# Altium schematic sheet KEY_GPIO_NANDF_ENET.SchDoc
size A4
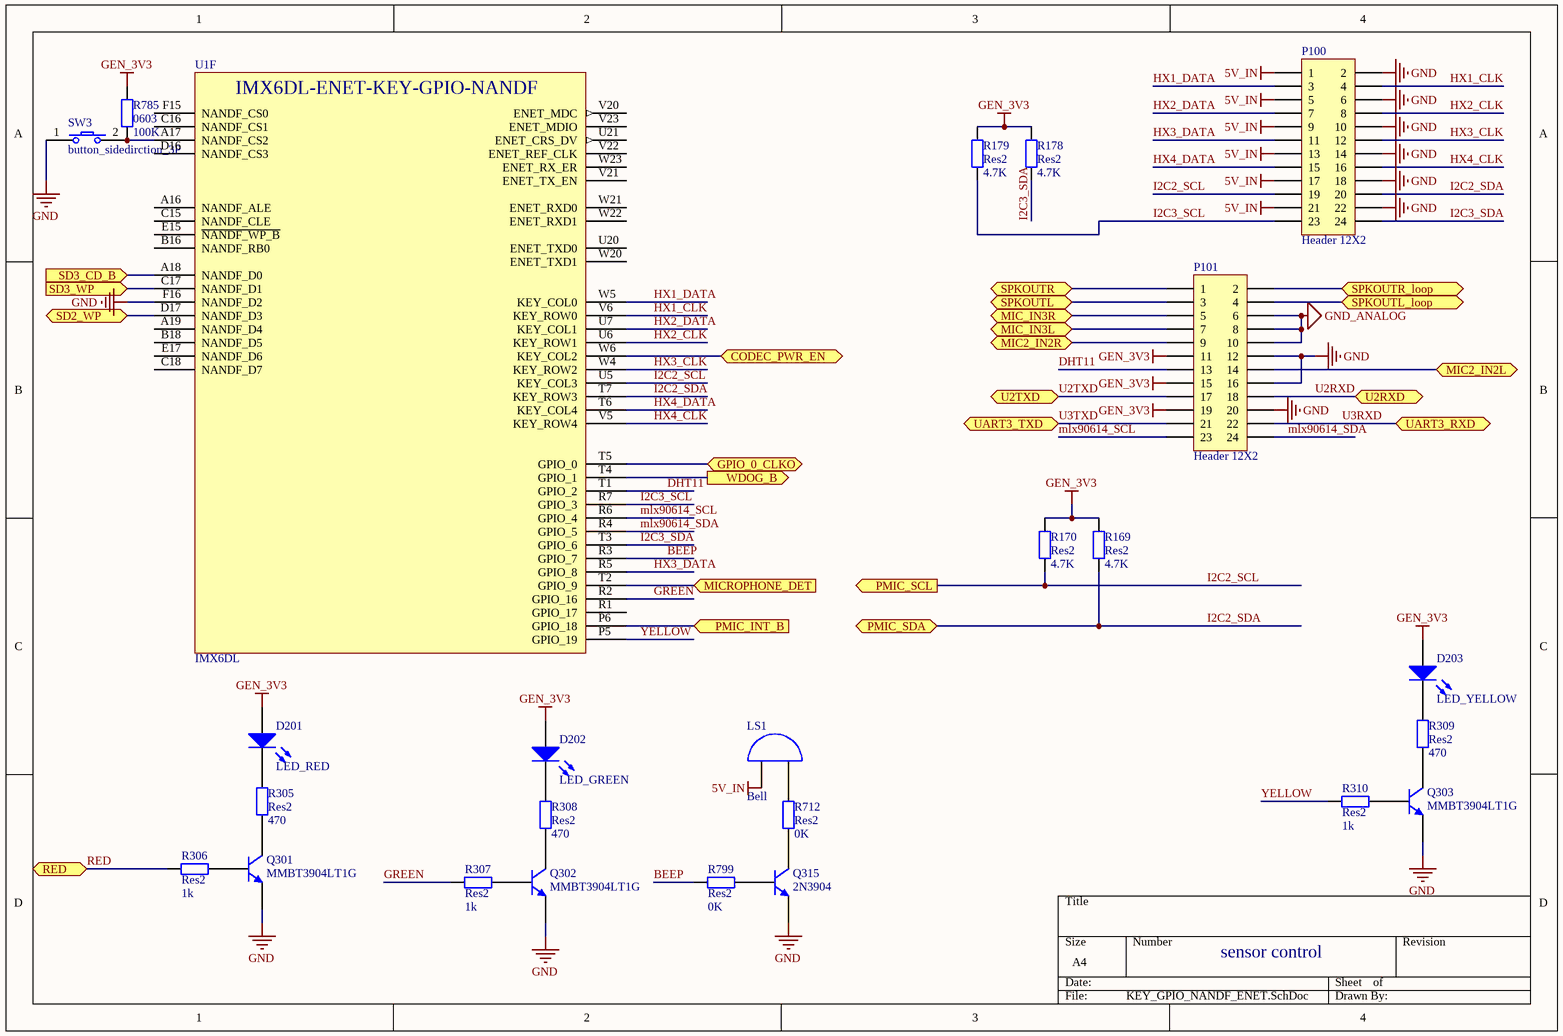
[diagram p0: KEY_GPIO_NANDF_ENET.SchDoc]

## Parts
D201  LED_RED  [LED_0603]
D202  LED_GREEN  [LED_0603]
D203  LED_YELLOW  [LED_0603]
LS1  Bell  [PIN2]
P100  Header 12X2  [Double Row _DIP43025- 2P-24P]
P101  Header 12X2  [Double Row _DIP43025- 2P-24P]
Q301  MMBT3904LT1G  [MMBT3904LT1G-SOT23]
Q302  MMBT3904LT1G  [MMBT3904LT1G-SOT23]
Q303  MMBT3904LT1G  [MMBT3904LT1G-SOT23]
Q315  2N3904  [BCY-W3/E4]
R169  Res2  value 4.7K  [0402]
R170  Res2  value 4.7K  [0402]
R178  Res2  value 4.7K  [0402]
R179  Res2  value 4.7K  [0402]
R305  Res2  value 470  [0603]
R306  Res2  value 1k  [0603]
R307  Res2  value 1k  [0603]
R308  Res2  value 470  [0603]
R309  Res2  value 470  [0603]
R310  Res2  value 1k  [0603]
R712  Res2  value 0K  [0603]
R785  0603  value 100K  [0603]
R799  Res2  value 0K  [0603]
SW3  button_sidedirction_3P  [button_sidedirction_3P 4.5X4.5]
U1  IMX6DL  [IMX6DL-BGA624x25]  (part F of 8)

## Ports
CODEC_PWR_EN, GPIO_0_CLKO (bidir), MIC2_IN2L, MIC2_IN2R, MIC_IN3L, MIC_IN3R, MICROPHONE_DET (in), PMIC_INT_B (in), PMIC_SCL (out), PMIC_SDA, RED, SD2_WP, SD3_CD_B (in), SD3_WP (in), SPKOUTL, SPKOUTL_loop, SPKOUTR, SPKOUTR_loop, U2RXD, U2TXD, UART3_RXD, UART3_TXD, WDOG_B (out)

## Nets
5V_IN: LS1.1(A) P100.1 P100.5 P100.9 P100.13 P100.17 P100.21
GEN_3V3: D201.1(A) D202.1(A) D203.1(A) P101.11 P101.15 P101.19 R169.2 R170.2 R178.2 R179.2 R785.2
GND: P100.2 P100.6 P100.10 P100.14 P100.18 P100.22 P101.12 P101.16 P101.20 Q301.2(E) Q302.2(E) Q303.2(E) Q315.1(E) SW3.1 U1.F16(NANDF_D2)
GND_ANALOG: P101.6 P101.8 P101.10
BEEP: R799.2 U1.R3(GPIO_7)
CODEC_PWR_EN: U1.W6(KEY_COL2) ; port CODEC_PWR_EN
DHT11: P101.13 U1.T1(GPIO_2)
GPIO_0_CLKO: U1.T5(GPIO_0) ; port GPIO_0_CLKO
GREEN: R307.2 U1.R2(GPIO_16)
HX1_CLK: P100.4 U1.V6(KEY_ROW0)
HX1_DATA: P100.3 U1.W5(KEY_COL0)
HX2_CLK: P100.8 U1.U6(KEY_ROW1)
HX2_DATA: P100.7 U1.U7(KEY_COL1)
HX3_CLK: P100.12 U1.W4(KEY_ROW2)
HX3_DATA: P100.11 U1.R5(GPIO_8)
HX4_CLK: P100.16 U1.V5(KEY_ROW4)
HX4_DATA: P100.15 U1.T6(KEY_COL4)
I2C2_SCL: P100.19 R170.1 U1.U5(KEY_COL3) ; port PMIC_SCL
I2C2_SDA: P100.20 R169.1 U1.T7(KEY_ROW3) ; port PMIC_SDA
I2C3_SCL: P100.23 R179.1 U1.R7(GPIO_3)
I2C3_SDA: P100.24 R178.1 U1.T3(GPIO_6)
MIC2_IN2L: P101.14 ; port MIC2_IN2L
MIC2_IN2R: P101.9 ; port MIC2_IN2R
MIC_IN3L: P101.7 ; port MIC_IN3L
MIC_IN3R: P101.5 ; port MIC_IN3R
MICROPHONE_DET: U1.T2(GPIO_9) ; port MICROPHONE_DET
mlx90614_SCL: P101.23 U1.R6(GPIO_4)
mlx90614_SDA: P101.24 U1.R4(GPIO_5)
PMIC_INT_B: U1.P6(GPIO_18) ; port PMIC_INT_B
RED: R306.2 ; port RED
SD2_WP: U1.D17(NANDF_D3) ; port SD2_WP
SD3_CD_B: U1.A18(NANDF_D0) ; port SD3_CD_B
SD3_WP: U1.C17(NANDF_D1) ; port SD3_WP
SPKOUTL: P101.3 ; port SPKOUTL
SPKOUTL_loop: P101.4 ; port SPKOUTL_loop
SPKOUTR: P101.1 ; port SPKOUTR
SPKOUTR_loop: P101.2 ; port SPKOUTR_loop
U2RXD: P101.18 ; port U2RXD
U2TXD: P101.17 ; port U2TXD
U3RXD: P101.22 ; port UART3_RXD
U3TXD: P101.21 ; port UART3_TXD
WDOG_B: U1.T4(GPIO_1) ; port WDOG_B
YELLOW: R310.2 U1.P5(GPIO_19)
NetD201_2: D201.2(K) R305.2
NetD202_2: D202.2(K) R308.2
NetD203_2: D203.2(K) R309.2
NetLS1_2: LS1.2(B) R712.1
NetQ301_1: Q301.1(B) R306.1
NetQ301_3: Q301.3 R305.1
NetQ302_1: Q302.1(B) R307.1
NetQ302_3: Q302.3 R308.1
NetQ303_1: Q303.1(B) R310.1
NetQ303_3: Q303.3 R309.1
NetQ315_2: Q315.2(B) R799.1
NetQ315_3: Q315.3(C) R712.2
NetR785_1: R785.1 SW3.2 U1.A17(NANDF_CS2)

Not connected (* = marked no-connect by the designer): U1 A16(NANDF_ALE) A19(NANDF_D4) B16(NANDF_RB0) B18(NANDF_D5) C15(NANDF_CLE) C16(NANDF_CS1) C18(NANDF_D7) D16(NANDF_CS3) E15(~{NANDF_WP_B}) E17(NANDF_D6) F15(NANDF_CS0) R1(GPIO_17) U20(ENET_TXD0) U21(ENET_CRS_DV) V20(ENET_MDC) V21(ENET_TX_EN) V22(ENET_REF_CLK) V23(ENET_MDIO) W20(ENET_TXD1) W21(ENET_RXD0) W22(ENET_RXD1) W23(ENET_RX_ER)

## Notes on the sheet
- sensor control
- (in symbol IMX6DL, part F) IMX6DL-ENET-KEY-GPIO-NANDF

## Library data of the parts
D201-D203 = LED0: Typical INFRARED GaAs LED; Published: 8-Jun-2000; LatestRevisionDate: 08-Jul-2005; LatestRevisionNote: Mech Layer 1 removed.; PackageReference: LED-0; Publisher: Altium Limited
LS1 = Bell: Electrical Bell; Published: 24-Mar-1999; LatestRevisionDate: 17-Jul-2002; LatestRevisionNote: Re-released for DXP Platform.; PackageReference: PIN2; Publisher: Altium Limited
P100 P101 = Header 12X2: Header, 12-Pin, Dual row; LatestRevisionDate: 17-Jul-2002; LatestRevisionNote: Re-released for DXP Platform.; Publisher: Altium Limited
Q315 = 2N3904: NPN General Purpose Amplifier; Published: 8-Jun-2000; LatestRevisionDate: 15-Jan-2003; LatestRevisionNote: PCB Footprint 'BCY-W3/D4.7' replaced; DatasheetVersion: 1997; PackageVersion: Sep-1998; PackageReference: TO-92A; Publisher: Altium Limited; Code_JEDEC: TO-92A; ComponentLink1Description: Manufacturer Link; ComponentLink1URL: http://www.fairchildsemi.com/; ComponentLink2Description: Datasheet; ComponentLink2URL: http://www.fairchildsemi.com/ds/2N%2F2N3904.pdf
R169 R170 R178 R179 R305-R310 R712 R785 R799 = Res2: Resistor; Published: 8-Jun-2000; LatestRevisionDate: 17-Jul-2002; LatestRevisionNote: Re-released for DXP Platform.; PackageReference: AXIAL-0.4; Publisher: Altium Limited